# EAGLE board Proiect_TSC (EAGLE 9.7.0)
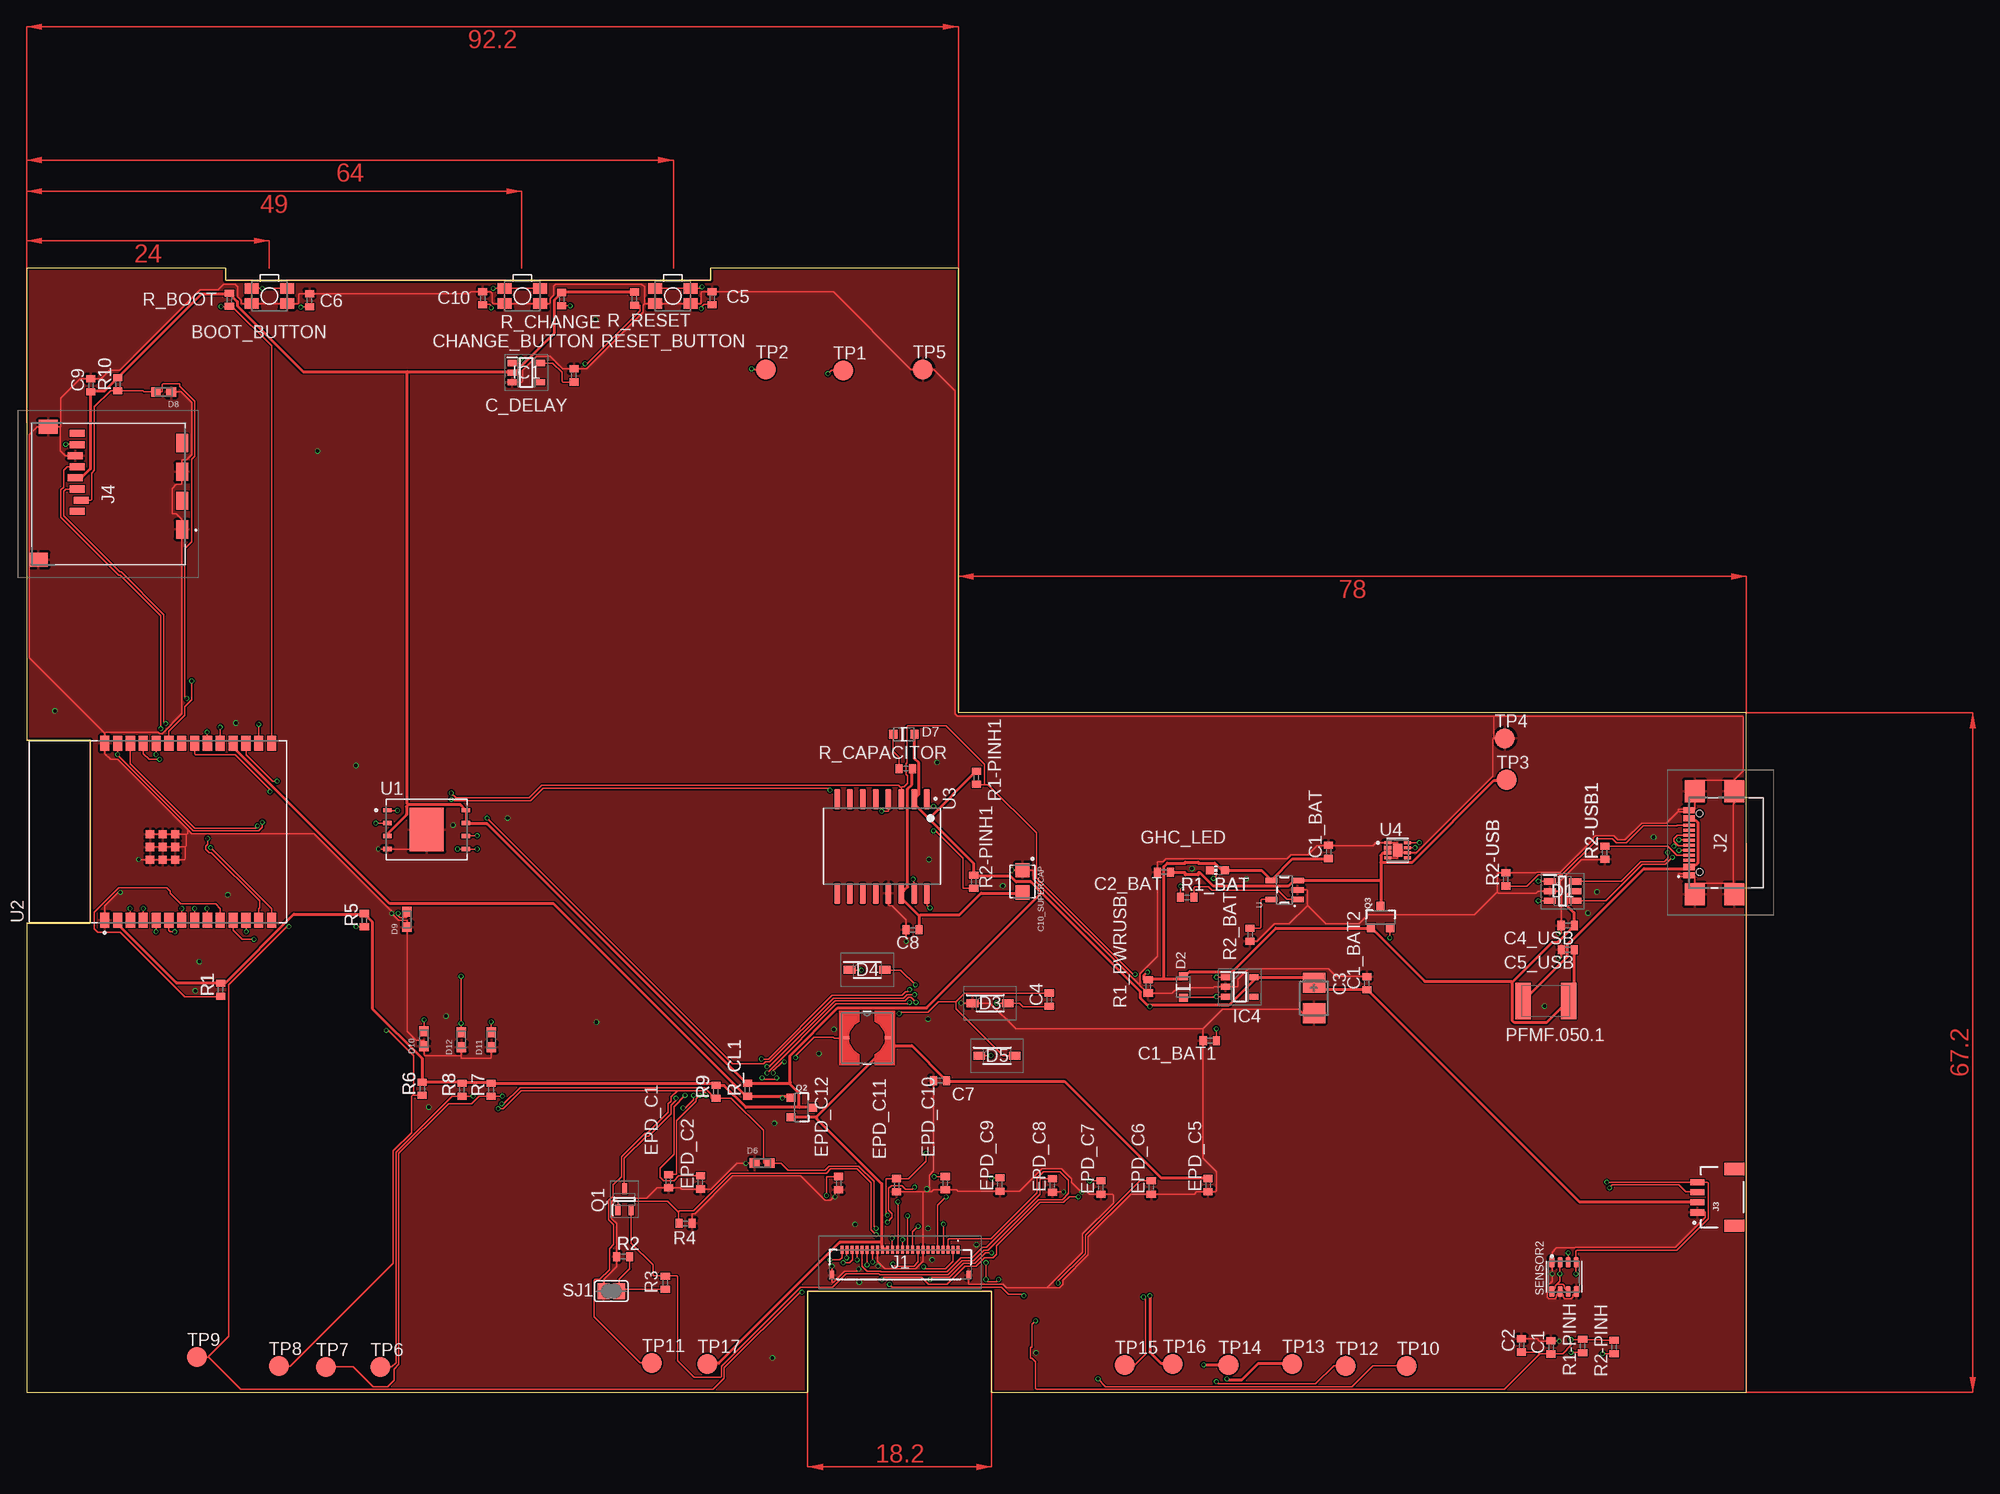
[diagram p1: board, top side]
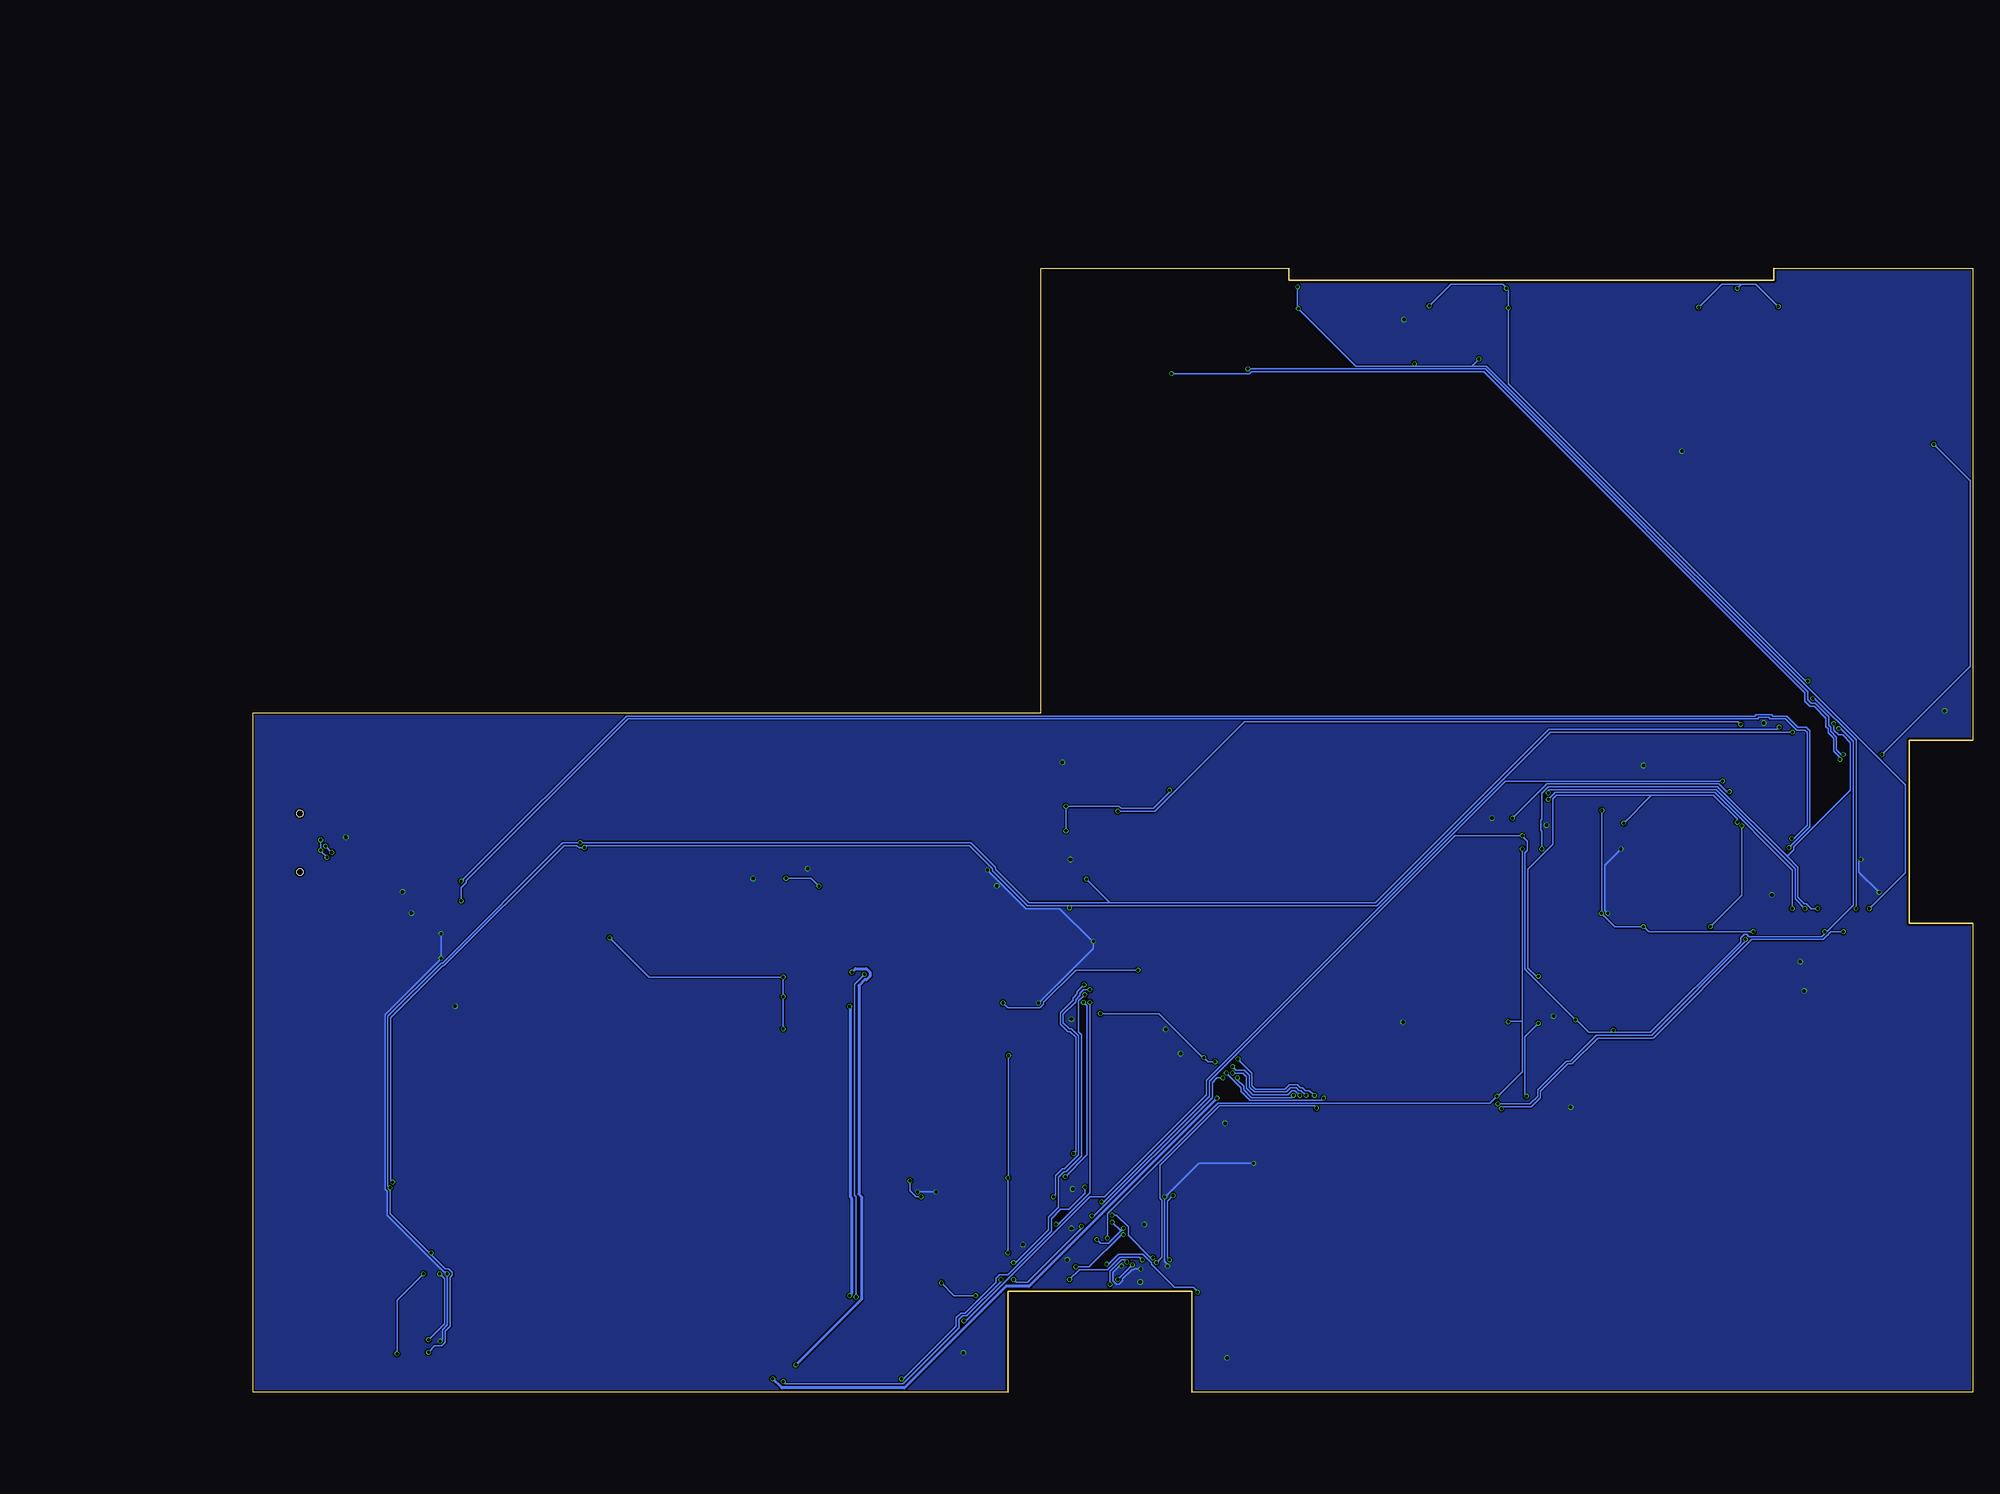
[diagram p2: board, bottom side, seen from below]

Size 170.2 x 111.2 mm. Coordinates in mm from the lower left corner, seen from the top.
Outline: 0,0 77.3,0 77.3,10 95.5,10 95.5,0 170.2,0 170.2,67.2 92.2,67.2 92.2,111.2 67.7,111.2 67.7,110 19.7,110 19.7,111.2 0,111.2 0,64.5 6.3,64.5 6.3,46.4 0,46.4 0,0
Copper layers (1*16): Top 0.035mm / dielectric 1.6mm / Bottom 0.035mm
Design rules "jlcpcb-2layers.dru *": minimum track width 0.15mm, minimum drill 0.3mm, track to track 5mil, track to pad 5mil, pad to pad 5mil, via to via 5mil, smd to smd 5mil, copper to edge 0.2mm, drill to drill 6mil, minimum pad ring 10mil, minimum via ring 3mil, stop-mask expansion 4mil, vias tented up to drill 0mil, thermal gap 10mil
Net classes: 0 default: width 0.15 mm; 1 custom_net_class: width 0.3 mm

## Footprints (pad centres in the part's own frame; a part is rotated, then mirrored left to right if it is on the bottom)
MYBUTTON = smd 1.4 x 1.05: 1 1.75,0.75; 2 -1.75,0.75; 3 -1.75,-0.75; 4 1.75,-0.75
ESP32_WROVER_EAGLE-LTSPICE_C0402 = smd 0.7 x 0.9: 1 -0.65,0; 2 0.65,0
EAGLE-LTSPICE_C0402 = smd 0.7 x 0.9: 1 -0.65,0; 2 0.65,0
RCL_CT3528 = smd 2 x 2.2: + -1.5,0; - 1.5,0
CAPCP3225X100N = smd 1.4 x 1.4: 1 -1.1,0; 2 1.1,0
SOT95P280X145-6N = smd 1.2 x 0.6: 1 -1.25,0.95; 2 -1.25,0; 3 -1.25,-0.95; 4 1.25,-0.95; 5 1.25,0; 6 1.25,0.95
ESP32_WROVER_AVX---SD0805S020S1R0_AVX_SD0805S020S1R0_0 = smd 0.8 x 0.9: 1 -1.05,0; 2 1.05,0
SOD3716X135N = smd 1.15 x 0.8: 1 -1.75,0; 2 1.75,0
DIOC1608X36N = smd 0.97 x 0.94: 1 -0.75,0; 2 0.75,0
ADAFRUIT_CHIP-LED0603 = smd 0.8 x 0.8: A 0,-0.75; C 0,0.75
SOT95P280X125-5N = smd 0.9 x 0.6: 1 -1.4,0.95; 2 -1.4,0; 3 -1.4,-0.95; 4 1.4,-0.95; 5 1.4,0.95
SOT95P280X120-5N = smd 0.9 x 0.6: 1 -1.4,0.95; 2 -1.4,0; 3 -1.4,-0.95; 4 1.4,-0.95; 5 1.4,0.95
FH34SRJ24S05SH99 = smd 0.3 x 0.8: 1 5.75,1.45; 2 5.25,1.45; 3 4.75,1.45; 4 4.25,1.45; 5 3.75,1.45; 6 3.25,1.45; 7 2.75,1.45; 8 2.25,1.45; 9 1.75,1.45; 10 1.25,1.45; 11 0.75,1.45; 12 0.25,1.45; 13 -0.25,1.45; 14 -0.75,1.45; 15 -1.25,1.45; 16 -1.75,1.45; 17 -2.25,1.45; 18 -2.75,1.45; 19 -3.25,1.45; 20 -3.75,1.45; 21 -4.25,1.45; 22 -4.75,1.45; 23 -5.25,1.45; 24 -5.75,1.45 | smd 0.4 x 0.8: MP1 6.75,-1.05; MP2 -6.75,-1.05
SAMACSYS_PARTS_USB4110GFA = smd 0.3 x 1.15: A1 -3.35,3.678; A4 -2.55,3.678; A5 -1.25,3.678; A6 -0.25,3.678; A7 0.25,3.678; A8 1.25,3.678; A9 2.55,3.678; A12 3.35,3.678; B1 3.05,3.678; B4 2.25,3.678; B5 1.75,3.678; B6 0.75,3.678; B7 -0.75,3.678; B8 -1.75,3.678; B9 -2.25,3.678; B12 -3.05,3.678 | smd 2.18 x 2: MP1 -5.11,-0.827; MP2 5.11,-0.827; MP3 -5.11,3.103; MP4 5.11,3.103 | hole 0.65: -2.89,2.603; 2.89,2.603
JST04_1MM_RA = smd 0.6 x 1.35: 1 -1.5,0; 2 -0.5,0; 3 0.5,0; 4 1.5,0 | smd 1.2 x 2: NC1 2.8,-3.675; NC2 -2.8,-3.675
112ATAARR03ATTEND = smd 1.8 x 1.2: G1 10.6,10.4; G2 4.9,10.4; S1 7.75,10.4; S2 2.05,10.4 | smd 1.4 x 1.9: G3 13.6,-3.85; G4 0.45,-2.85 | smd 0.7 x 1.5: P1 8.8,0; P2 7.7,0.4; P3 6.6,0; P4 5.5,-0.2; P5 4.4,0; P6 3.3,-0.2; P7 2.2,0; P8 1.1,0
IND_4828-WE-TPC_WRE = smd 0.61 x 0.305: 1 -2.086,0; 2 2.086,0
ESP32C6_VARISTOR_CT/CN1812 = smd 1.5 x 3.6: 1 -2.25,0; 2 2.25,0
SOT65P210X110-3N = smd 1.05 x 0.5: 1 -1.05,0.65; 2 -1.05,-0.65; 3 1.05,0
ESP32_WROVER_SPARKFUN-DISCRETESEMI_SOT23-3 = smd 0.8 x 0.9: 1 -0.95,-1; 2 0.95,-1; 3 0,1.1
ESP32_WROVER_EAGLE-LTSPICE_R0402 = smd 0.7 x 0.9: 1 -0.65,0; 2 0.65,0
ESP32_WROVER_BME680_PSON80P300X300X100-8N = smd 1.016 x 0.5: 1 1.458,1.2; 2 1.458,0.4; 3 1.458,-0.4; 4 1.458,-1.2; 5 -1.458,-1.22; 6 -1.458,-0.4; 7 -1.458,0.4; 8 -1.458,1.2
SJ = smd 1.168 x 1.6: 1 -0.762,0; 2 0.762,0
TP20R = smd 2 x 2: TP 0,0
ESP32_WROVER_SPARKFUN-IC-POWER_SOT23-5 = smd 0.55 x 1.2: 1 -0.95,-1.3; 2 0,-1.3; 3 0.95,-1.3; 4 0.95,1.3; 5 -0.95,1.3
SON127P600X800X80-9N = smd 0.94 x 0.44: 1 -3.895,1.905; 2 -3.895,0.635; 3 -3.895,-0.635; 4 -3.895,-1.905; 5 3.895,-1.905; 6 3.895,-0.635; 7 3.895,0.635; 8 3.895,1.905 | smd 3.4 x 4.3: 9 0,0
XCVR_ESP32-C6-WROOM-1-N8 = smd 1.5 x 0.9: 1 -8.75,5.26; 2 -8.75,3.99; 3 -8.75,2.72; 4 -8.75,1.45; 5 -8.75,0.18; 6 -8.75,-1.09; 7 -8.75,-2.36; 8 -8.75,-3.63; 9 -8.75,-4.9; 10 -8.75,-6.17; 11 -8.75,-7.44; 12 -8.75,-8.71; 13 -8.75,-9.98; 14 -8.75,-11.25; 15 8.75,-11.25; 16 8.75,-9.98; 17 8.75,-8.71; 18 8.75,-7.44; 19 8.75,-6.17; 20 8.75,-4.9; 21 8.75,-3.63; 22 8.75,-2.36; 23 8.75,-1.09; 24 8.75,0.18; 25 8.75,1.45; 26 8.75,2.72; 27 8.75,3.99; 28 8.75,5.26 | smd 0.8 x 0.8: 29_1 -2.755,0.79; 29_2 -1.505,0.79; 29_3 -0.255,0.79; 29_4 -2.755,-0.46; 29_5 -1.505,-0.46; 29_6 -0.255,-0.46; 29_7 -2.755,-1.71; 29_8 -1.505,-1.71; 29_9 -0.255,-1.71
SOIC127P1032X265-16N = smd 2.05 x 0.59: 1 -4.655,4.445; 2 -4.655,3.175; 3 -4.655,1.905; 4 -4.655,0.635; 5 -4.655,-0.635; 6 -4.655,-1.905; 7 -4.655,-3.175; 8 -4.655,-4.445; 9 4.655,-4.445; 10 4.655,-3.175; 11 4.655,-1.905; 12 4.655,-0.635; 13 4.655,0.635; 14 4.655,1.905; 15 4.655,3.175; 16 4.655,4.445
SON50P200X200X80-9N = smd 0.76 x 0.27: 1 -0.985,0.75; 4 -0.985,-0.75; 5 0.985,-0.75; 6 0.985,-0.25; 7 0.985,0.25; 8 0.985,0.75 | smd 0.813 x 0.406: 2 -0.985,0.25; 3 -0.985,-0.25 | smd 0.9 x 1.3: 9 0,0

## Placement (x,y rotation side)
BOOT_BUTTON  BUTTON_CUSYOMV1  [MYBUTTON]  24.03,108.45 180 top
C1  100nF  [ESP32_WROVER_EAGLE-LTSPICE_C0402]  150.84,4.43 90 top
C1_BAT  4.7uF  [EAGLE-LTSPICE_C0402]  128.83,53.45 90 top
C1_BAT1  4.7uF  [EAGLE-LTSPICE_C0402]  117.08,34.77 180 top
C1_BAT2  4.7uf  [EAGLE-LTSPICE_C0402]  132.62,40.47 90 top
C2  100nF  [ESP32_WROVER_EAGLE-LTSPICE_C0402]  147.92,4.63 90 top
C2_BAT  4.7uF  [EAGLE-LTSPICE_C0402]  112.55,51.45 180 top
C3  100uF TANT  [RCL_CT3528]  127.41,39 270 top
C4  4.7uF/25V  [ESP32_WROVER_EAGLE-LTSPICE_C0402]  101.2,38.84 90 top
C4_USB  100nF  [ESP32_WROVER_EAGLE-LTSPICE_C0402]  152.5,46.17 180 top
C5  1uF  [ESP32_WROVER_EAGLE-LTSPICE_C0402]  67.85,108.23 90 top
C5_USB  4.7uF  [ESP32_WROVER_EAGLE-LTSPICE_C0402]  152.51,43.77 180 top
C6  100nF  [ESP32_WROVER_EAGLE-LTSPICE_C0402]  28,108.03 90 top
C7  10uF  [ESP32_WROVER_EAGLE-LTSPICE_C0402]  90.39,30.83 180 top
C8  100nF  [ESP32_WROVER_EAGLE-LTSPICE_C0402]  87.68,45.73 180 top
C9  100nF  [ESP32_WROVER_EAGLE-LTSPICE_C0402]  6.36,99.63 90 top
C10  100nF  [ESP32_WROVER_EAGLE-LTSPICE_C0402]  45.14,108.23 90 top
C10_SUPERCAP  CPH3225A  [CAPCP3225X100N]  98.56,50.54 270 top
C_DELAY  100nF  [ESP32_WROVER_EAGLE-LTSPICE_C0402]  54.17,100.59 90 top
CHANGE_BUTTON  BUTTON_CUSYOMV1  [MYBUTTON]  49.06,108.45 180 top
D1  USBLC6-2SC6Y  [SOT95P280X145-6N]  151.98,49.57 0 top
D2  SD0805S020S1R0  [ESP32_WROVER_AVX---SD0805S020S1R0_AVX_SD0805S020S1R0_0]  114.46,40.08 90 top
D3  MBR0530  [SOD3716X135N]  95.35,38.48 0 top
D4  MBR0530  [SOD3716X135N]  83.19,41.78 0 top
D5  MBR0530  [SOD3716X135N]  96.03,33.28 0 top
D6  PGB1010603MR  [DIOC1608X36N]  72.78,22.67 0 top
D7  ESP32_WROVER_AVX---SD0805S020S1R0_AVX_SD0805S020S1R0_0_0AVX_SD0805S020S1R0_0_0  [ESP32_WROVER_AVX---SD0805S020S1R0_AVX_SD0805S020S1R0_0]  86.81,65.08 0 top
D8  PGB1010603MR  [DIOC1608X36N]  13.56,98.97 180 top
D9  PGB1010603MR  [DIOC1608X36N]  37.64,46.77 90 top
D10  PGB1010603MR  [DIOC1608X36N]  39.32,34.97 90 top
D11  PGB1010603MR  [DIOC1608X36N]  46,34.87 90 top
D12  PGB1010603MR  [DIOC1608X36N]  43.03,34.87 90 top
EPD_C1  1uF/50V  [ESP32_WROVER_EAGLE-LTSPICE_C0402]  63.52,20.87 90 top
EPD_C2  1uF/50V  [ESP32_WROVER_EAGLE-LTSPICE_C0402]  66.68,20.75 90 top
EPD_C5  0.1uF/50V  [ESP32_WROVER_EAGLE-LTSPICE_C0402]  116.91,20.49 90 top
EPD_C6  1uF/50V  [ESP32_WROVER_EAGLE-LTSPICE_C0402]  111.29,20.25 90 top
EPD_C7  1uF/50V  [ESP32_WROVER_EAGLE-LTSPICE_C0402]  106.3,20.25 90 top
EPD_C8  1uF/50V  [ESP32_WROVER_EAGLE-LTSPICE_C0402]  101.51,20.45 90 top
EPD_C9  1uF/50V  [ESP32_WROVER_EAGLE-LTSPICE_C0402]  96.32,20.55 90 top
EPD_C10  1uF/50V  [ESP32_WROVER_EAGLE-LTSPICE_C0402]  90.91,20.69 90 top
EPD_C11  1uF/50V  [ESP32_WROVER_EAGLE-LTSPICE_C0402]  86.09,20.49 90 top
EPD_C12  1uF/50V  [ESP32_WROVER_EAGLE-LTSPICE_C0402]  80.35,20.69 90 top
GHC_LED  [ADAFRUIT_CHIP-LED0603]  117.84,51.65 90 top
IC1  BD5229G-TR  [SOT95P280X125-5N]  49.45,100.87 0 top
IC4  XC6220A331MR-G  [SOT95P280X120-5N]  120.05,40.09 0 top
J1  FH34SRJ-24S-0.5SH_99_  [FH34SRJ24S05SH99]  86.44,12.64 0 top
J2  SAMACSYS_PARTS_USB4110-GF-A  [SAMACSYS_PARTS_USB4110GFA]  168.17,54.36 90 top
J3  QWIIC_RIGHT_ANGLE  [JST04_1MM_RA]  165.32,19.28 90 top
J4  112A-TAAR-R03_ATTEND  [112ATAARR03ATTEND]  5,95.95 270 top
L1  68uH  [IND_4828-WE-TPC_WRE]  83.17,35.05 0 top
PFMF.050.1  ESP32C6_VARISTORCN1812  [ESP32C6_VARISTOR_CT/CN1812]  150.34,38.7 0 top
Q1  SI1308EDL-T1-GE3  [SOT65P210X110-3N]  59.16,19.08 90 top
Q2  20V/4.2A/52mΩ/1.4W  [ESP32_WROVER_SPARKFUN-DISCRETESEMI_SOT23-3]  76.66,28.16 270 top
Q3  20V/4.2A/52mΩ/1.4W  [ESP32_WROVER_SPARKFUN-DISCRETESEMI_SOT23-3]  133.98,46.96 0 top
R1  10k  [ESP32_WROVER_EAGLE-LTSPICE_R0402]  19.19,39.81 90 top
R1-PINH  10k  [ESP32_WROVER_EAGLE-LTSPICE_R0402]  153.98,4.57 90 top
R1-PINH1  10k  [ESP32_WROVER_EAGLE-LTSPICE_R0402]  93.99,60.79 90 top
R1_BAT  200  [ESP32_WROVER_EAGLE-LTSPICE_R0402]  114.85,48.95 0 top
R1_PWRUSB  100k  [ESP32_WROVER_EAGLE-LTSPICE_R0402]  110.99,40.14 90 top
R2  2.2  [ESP32_WROVER_EAGLE-LTSPICE_R0402]  59.03,13.41 0 top
R2-PINH  10k  [ESP32_WROVER_EAGLE-LTSPICE_R0402]  157.09,4.47 90 top
R2-PINH1  10k  [ESP32_WROVER_EAGLE-LTSPICE_R0402]  93.73,50.49 90 top
R2-USB  5k1  [ESP32_WROVER_EAGLE-LTSPICE_R0402]  146.38,50.73 90 top
R2-USB1  5k1  [ESP32_WROVER_EAGLE-LTSPICE_R0402]  156.16,53.37 90 top
R2_BAT  2k  [ESP32_WROVER_EAGLE-LTSPICE_R0402]  121.06,45.25 90 top
R3  0.47  [ESP32_WROVER_EAGLE-LTSPICE_R0402]  63.21,10.83 90 top
R4  10k  [ESP32_WROVER_EAGLE-LTSPICE_R0402]  65.21,16.71 180 top
R5  10k  [ESP32_WROVER_EAGLE-LTSPICE_R0402]  33.43,46.71 90 top
R6  10k  [ESP32_WROVER_EAGLE-LTSPICE_R0402]  39.15,30.01 90 top
R7  10k  [ESP32_WROVER_EAGLE-LTSPICE_R0402]  45.97,29.91 90 top
R8  10k  [ESP32_WROVER_EAGLE-LTSPICE_R0402]  43.09,29.91 90 top
R9  10k  [ESP32_WROVER_EAGLE-LTSPICE_R0402]  68.21,29.71 90 top
R10  10k  [ESP32_WROVER_EAGLE-LTSPICE_R0402]  9.03,99.73 90 top
R_BOOT  10k  [ESP32_WROVER_EAGLE-LTSPICE_R0402]  20.07,108.07 90 top
R_CAPACITOR  15  [ESP32_WROVER_EAGLE-LTSPICE_R0402]  87,61.68 0 top
R_CHANGE  10k  [ESP32_WROVER_EAGLE-LTSPICE_R0402]  52.96,108.14 90 top
R_CL1  10k  [ESP32_WROVER_EAGLE-LTSPICE_R0402]  71.33,29.93 90 top
R_RESET  10k  [ESP32_WROVER_EAGLE-LTSPICE_R0402]  60.15,108.19 90 top
RESET_BUTTON  BUTTON_CUSYOMV1  [MYBUTTON]  63.95,108.45 180 top
SENSOR2  BME688  [ESP32_WROVER_BME680_PSON80P300X300X100-8N]  152.14,11.42 90 top
SJ1  [SJ]  57.86,9.99 0 top
TP1  TPTP20R  [TP20R]  80.81,101.09 0 top
TP2  TPTP20R  [TP20R]  73.13,101.19 0 top
TP3  TPTP20R  [TP20R]  146.45,60.59 0 top
TP4  TPTP20R  [TP20R]  146.27,64.69 0 top
TP5  TPTP20R  [TP20R]  88.69,101.19 0 top
TP6  TPTP20R  [TP20R]  35.01,2.49 0 top
TP7  TPTP20R  [TP20R]  29.63,2.49 0 top
TP8  TPTP20R  [TP20R]  24.95,2.59 0 top
TP9  TPTP20R  [TP20R]  16.87,3.49 0 top
TP10  TPTP20R  [TP20R]  136.58,2.61 0 top
TP11  TPTP20R  [TP20R]  61.89,2.89 0 top
TP12  TPTP20R  [TP20R]  130.53,2.61 0 top
TP13  TPTP20R  [TP20R]  125.22,2.81 0 top
TP14  TPTP20R  [TP20R]  118.93,2.71 0 top
TP15  TPTP20R  [TP20R]  108.68,2.71 0 top
TP16  TPTP20R  [TP20R]  113.43,2.81 0 top
TP17  TPTP20R  [TP20R]  67.38,2.81 0 top
U  MCP73831  [ESP32_WROVER_SPARKFUN-IC-POWER_SOT23-5]  124.48,49.69 90 top
U1  W25Q512JVEIQ  [SON127P600X800X80-9N]  39.59,55.66 0 top
U2  ESP32-C6-WROOM-1-N8  [XCVR_ESP32-C6-WROOM-1-N8]  13,55.44 90 top
U3  DS3231SN#  [SOIC127P1032X265-16N]  84.65,54 270 top
U4  MAX17048G+T10  [SON50P200X200X80-9N]  135.67,53.62 0 top

## Tracks (layer width: path | path; a pad name or v marks a point on that pad's centre or on a via)
3V3  (via drill 0.3)
  Top 0.3: 89.3,56.75 87.88,58.17 87.88,58.66 U3.2 87.95,58.79 88.29,59.14 88.29,62.26 87.88,62.67 87.88,65.03 D7.2 | 89.3,56.75 93.69,52.35 93.69,51.18 R2-PINH1.2 93.83,51.04 97.36,51.04 97.92,50.48 99.37,50.48 100.45,49.41 | 89.3,56.75 93.97,61.42 R1-PINH1.2 | J3.2 165.3,18.84 153.67,18.84 132.75,39.75 C1_BAT2.1 132.61,39.89 127.97,39.89 127.49,40.37 C3.+ 127.35,40.51 126.87,41 121.47,41 IC4.5 121.53,40.86 118.97,38.3 111.15,38.3 | 100.45,49.41 110.25,39.61 110.25,38.99 110.94,38.3 111.15,38.3 | R_RESET.2 60.11,108.86 53.05,108.86 R_CHANGE.2 52.91,108.72 52.22,108.03 52.22,104.78 48.34,100.9 48.06,100.9 IC1.2 47.92,100.97 37.67,100.97 | J4.P4 4.85,90.51 5.47,90.51 6.3,91.34 6.3,98.89 C9.1 6.37,99.03 7.69,99.03 9,100.34 R10.2 9.14,100.48 17.31,108.65 20.01,108.65 R_BOOT.2 20.15,108.58 20.84,107.89 20.84,107.48 27.35,100.97 37.67,100.97 | U2.2 9.07,46.67 9.07,46.26 14.82,40.51 19.18,40.51 R1.2 19.32,40.58 19.74,40.58 26.45,47.3 33.38,47.3 R5.2 33.52,47.23 34.21,46.54 34.21,37.95 39.13,33.03 39.13,30.82 R6.2 39.2,30.68 43,30.68 R8.2 43.14,30.61 45.91,30.61 R7.2 46.12,30.54 67.93,30.54 68.07,30.4 R9.2 68.21,30.33 69.04,30.33 71.19,28.18 76.45,28.18 | 37.74,58.1 37.6,57.96 37.6,57.13 35.73,55.26 35.73,55.05 U1.3 | 37.74,58.1 42.94,58.1 43.42,57.62 U1.8 43.49,57.48 U1.7 43.63,56.23 45.57,56.23 71.19,30.61 R_CL1.2 71.4,30.54 75.48,30.54 | 76.45,28.18 77.7,28.18 Q2.3 | 75.48,30.54 76.45,29.57 76.45,28.18 | 37.67,100.97 37.67,58.24 37.74,58.1 | 100.45,49.41 89.06,38.02 80.26,38.02 75.55,33.31 75.55,30.68 75.48,30.54 | v111.15,9.56 111.15,3.95 112.25,2.84 113.36,2.84 TP16.TP
  Top 0.3: v111.15,38.16 111.15,38.3
  Bottom 0.3: v111.15,9.56 110.94,9.76 110.94,19.18 111.08,19.32 111.08,38.09 v111.15,38.16
32KHZ  (via drill 0.3)
  Top 0.15: v89.75,55.54 89.96,55.54 92.66,52.84 92.66,49.93 92.73,49.86 93.69,49.86 R2-PINH1.1 | v89.75,57.96 89.12,57.96 89.12,58.66 U3.1 | v17.87,47.85 17.87,46.74 U2.9 | v42.03,58.66 42.24,58.66 42.38,58.52 49.86,58.52 51.11,59.76 79.29,59.76 v79.5,59.55
  Bottom 0.15: v89.75,55.54 v89.75,57.96 84.48,57.96 84.28,57.76 81.09,57.76 79.5,59.35 v79.5,59.55 | v17.87,47.85 17.87,51.66 25.55,59.35 41.34,59.35 v42.03,58.66
DN  (via drill 0.3)
  Top 0.15: v163.5,53.6 164.47,53.6 J2.B7 | v163.5,54.64 164.47,54.64 J2.A7 | v162.88,52.91 162.18,52.22 159.9,52.22 156.3,48.61 153.25,48.61 D1.4
  Bottom 0.15: v163.5,54.64 v163.5,53.6 163.5,53.53 v162.88,52.91
DP  (via drill 0.3)
  Top 0.15: 163.26,54.26 163.01,54.5 163.01,54.78 163.36,55.12 164.47,55.12 J2.B6 | 163.26,54.26 163.43,54.08 164.47,54.08 J2.A6 | v162.39,53.39 162.39,52.84 162.04,52.49 159.76,52.49 157.82,50.55 153.25,50.55 D1.6 | 163.26,54.26 v163.01,54.02
  Bottom 0.15: v163.01,54.02 v162.39,53.39
EPD_3V3
  Top 0.3: J1.15 85.18,14.13 84.69,14.13 J1.16 84.62,14.27 84.62,14.82 | 78.11,27.21 75.69,27.21 Q2.2 | 85.25,34.35 78.11,27.21 | 85.25,34.35 85.25,35.04 L1.2 | 85.25,34.35 85.39,34.28 87.6,34.28 91,30.89 C7.1 91.13,30.75 102.7,30.75 112.25,21.19 116.89,21.19 EPD_C5.2 | 84.62,14.82 84.62,20.64 78.18,27.08 78.11,27.21 | 84.62,14.82 80.47,14.82 68.49,2.84 67.38,2.84 TP17.TP
EPD_3V3_C  (via drill 0.3)
  Top 0.3: 74.79,29.22 75.55,29.22 75.62,29.15 Q2.1 | 74.79,29.22 71.4,29.22 R_CL1.1 71.19,29.29 52.15,48.34 35.94,48.34 20.5,63.78 20.5,64.13 U2.18 | v118.76,1.32 118.83,1.25 120.29,1.25 121.88,2.84 125.2,2.84 TP13.TP | 74.79,29.22 v74.79,29.09
  Bottom 0.3: v118.76,1.32 117.86,0.41 105.75,0.41 95.7,10.46 93.42,10.46 v74.79,29.09
EPD_BUSY  (via drill 0.3)
  Top 0.15: v85.73,12.67 85.94,12.46 87.81,12.46 88.22,12.88 88.22,14.06 J1.9 | v76.73,9.9 76.52,9.9 69.04,2.42 69.04,1.39 67.93,0.28 21.19,0.28 18,3.46 | 18,3.46 16.9,3.46 TP9.TP | v22.85,56.02 22.64,55.82 16.62,55.82 10.25,62.19 10.25,64.13 U2.26 | v25.97,46.05 25.76,46.05 20.01,40.3 20.01,5.54 18,3.53 18,3.46
  Bottom 0.15: v85.73,12.67 85.52,12.67 84.55,13.64 82.13,13.64 81.3,12.81 81.3,12.67 79.01,10.39 77.14,10.39 76.73,9.97 v76.73,9.9 | v22.85,56.02 22.85,49.17 v25.97,46.05
EPD_CS  (via drill 0.3)
  Top 0.15: v86.7,15.1 86.7,14.13 J1.12 | v84.07,16.2 83.86,16.41 83.86,20.84 82.34,22.37 79.43,22.37 79.01,21.95 75.34,21.95 74.65,22.64 73.54,22.64 D6.2 73.47,22.64 72.99,22.64 72.92,22.71 72.92,25.9 69.73,29.09 68.21,29.09 R9.1 68.14,29.09 67.73,29.09 67.73,29.5 67.1,30.12 48.82,30.12 47.23,28.53 v47.02,28.53 | v22.51,44.8 21.33,44.8 20.43,45.7 20.43,46.67 U2.11 | v106.02,1.32 106.78,0.55 131.16,0.55 133.24,2.63 136.56,2.63 TP10.TP | v87.88,20.29 87.67,20.08 86.98,20.08 86.63,20.43 85.59,20.43 85.32,20.15 85.32,18 85.66,17.66 85.66,17.31 v85.18,16.83
  Bottom 0.15: v86.7,15.1 86.36,14.75 85.52,14.75 84.31,15.96 | v84.07,16.2 84.31,15.96 | v22.51,44.8 22.51,44.6 31.79,35.32 37.26,35.32 39.82,32.76 40.23,32.76 43.07,29.92 43.07,29.29 43.84,28.53 v47.02,28.53 | v106.02,1.32 105.81,1.32 100.62,6.51 100.62,7.34 100.14,7.83 99.72,7.83 96.67,10.87 96.67,11.29 96.33,11.63 95.5,11.63 91.2,15.93 91.2,17.17 90.3,18.07 89.47,18.07 87.88,19.67 v87.88,20.29 | 84.31,15.96 v85.18,16.83
EPD_DC  (via drill 0.3)
  Top 0.15: v87.19,17.45 87.19,14.13 J1.11 | v74.24,31.09 74.1,30.95 72.92,30.95 v72.78,31.09 | v67.24,29.36 67.24,29.57 66.97,29.85 64.4,29.85 | 64.4,29.85 63.78,29.22 63.78,28.81 63.5,28.53 63.5,27.7 61.42,25.62 61.22,25.62 58.86,23.27 58.86,21.33 58.03,20.5 58.03,19.39 57.62,18.97 57.62,17.04 58.1,16.55 58.1,14.61 57.69,14.2 57.69,12.12 56.72,11.15 56.23,11.15 56.16,11.08 56.16,7.48 60.73,2.91 61.84,2.91 TP11.TP | v12.81,45.57 12.81,46.67 U2.5 | v46.67,28.05 47.16,28.05 48.96,29.85 64.4,29.85
  Bottom 0.15: v87.19,17.45 86.98,17.45 75.28,29.15 75.28,30.61 74.79,31.09 v74.24,31.09 | v72.78,31.09 72.78,30.89 72.16,30.26 72.16,29.92 71.4,29.15 67.45,29.15 v67.24,29.36 | v12.81,45.57 14.06,45.57 14.34,45.29 14.34,45.22 14.4,45.22 14.82,44.8 21.88,44.8 31.65,35.04 37.12,35.04 39.68,32.48 40.1,32.48 42.8,29.78 42.8,29.15 43.7,28.25 46.47,28.25 v46.67,28.05
EPD_RST  (via drill 0.3)
  Top 0.15: v88.22,16.41 87.67,15.86 87.67,14.13 J1.10 | v96.19,11.15 95.98,10.94 95.15,10.94 v94.94,11.15 v94.94,12.81 | v117.72,1.04 117.93,0.83 127.56,0.83 129.36,2.63 130.47,2.63 TP12.TP | v24.1,59.42 24.1,59.62 20.64,63.09 16.69,63.09 16.62,63.16 16.62,64.13 U2.21 | v45.57,56.78 69.87,32.48 72.92,32.48 73.13,32.69 73.54,32.69 79.84,38.99 86.77,38.99 87.12,39.33 v87.88,39.33
  Bottom 0.15: v88.22,16.41 88.22,16.2 93.56,10.87 94.67,10.87 v94.94,11.15 | v96.19,11.15 96.19,10.94 99.58,7.55 100,7.55 100.34,7.2 100.34,6.37 105.88,0.83 117.52,0.83 v117.72,1.04 | v24.1,59.42 24.38,59.42 25.14,60.18 42.17,60.18 v45.57,56.78 | v87.88,39.33 88.5,38.71 88.5,35.66 88.22,35.39 88.22,23.34 89.75,21.81 89.96,21.81 90.51,21.26 90.51,18.28 91.48,17.31 91.48,16.07 94.73,12.81 v94.94,12.81
FLASH_CS  (via drill 0.3)
  Top 0.15: v32.62,46.05 33.38,46.05 R5.1 | v36.77,47.37 36.77,47.16 36.98,46.95 37.6,46.95 37.67,47.02 37.67,47.51 D9.2 | v36.7,57.55 35.73,57.55 U1.1 | v21.74,45.57 21.74,46.67 U2.12
  Bottom 0.15: v36.7,57.55 36.7,47.37 v36.77,47.37 35.46,46.05 v32.62,46.05 32.55,46.05 32.06,45.57 v21.74,45.57
GDR  (via drill 0.3)
  Top 0.15: v88.78,12.4 88.99,12.19 90.92,12.19 91.69,12.95 91.69,14.06 J1.2 | v84.07,15.58 83.58,16.07 83.58,20.71 82.2,22.09 79.57,22.09 79.15,21.68 69.73,21.68 66,17.94 64.61,17.94 64.54,17.87 | 64.54,17.87 64.54,16.76 R4.2 | Q1.1 58.52,18.07 58.52,18.84 58.59,18.91 63.43,18.91 64.47,17.87 64.54,17.87
  Bottom 0.15: v88.78,12.4 87.46,12.4 84.28,15.58 v84.07,15.58
GND  (via drill 0.3, 0.35)
  Top 0.15: IC1.3 49.03,99.93 49.1,100 49.1,101.11 50.48,102.49 51.8,102.49 53.05,101.24 54.15,101.24 C_DELAY.2 54.22,101.24 55.4,101.24 61.01,106.85 61.01,107.55 61.15,107.68 | 61.15,107.68 62.19,107.68 RESET_BUTTON.1 62.26,107.68 65.65,107.68 RESET_BUTTON.2 65.72,107.68 66.69,107.68 66.76,107.75 66.76,108.79 66.83,108.86 67.8,108.86 C5.2 67.86,108.86 79.84,108.86 87.53,101.17 88.64,101.17 TP5.TP 88.71,101.17 89.82,101.17 91.89,99.1 91.89,67.1 92.1,66.89 145.22,66.89 145.22,66.83 | 3.32,95.5 3.39,95.56 3.39,98.33 5.33,100.27 6.3,100.27 C9.2 6.37,100.27 7.41,100.27 8.24,101.11 9.21,101.11 17.17,109.07 18.97,109.07 19.53,109.62 20.64,109.62 20.91,109.35 20.91,108.38 21.26,108.03 21.26,107.75 21.33,107.68 22.23,107.68 BOOT_BUTTON.1 22.3,107.68 25.76,107.68 BOOT_BUTTON.2 25.83,107.68 26.87,107.68 26.94,107.75 26.94,108.58 27.01,108.65 27.98,108.65 C6.2 28.05,108.65 43.77,108.65 43.97,108.86 45.08,108.86 C10.2 45.15,108.86 45.91,108.86 46.05,108.72 46.05,107.82 46.19,107.68 47.3,107.68 CHANGE_BUTTON.1 47.37,107.68 50.76,107.68 CHANGE_BUTTON.2 50.83,107.68 51.73,107.68 51.8,107.75 51.8,108.17 52.15,108.52 52.15,109.42 52.35,109.62 60.87,109.62 61.15,109.35 61.15,107.68 | 3.32,95.5 2.22,95.5 J4.G4 2.08,95.5 1.04,95.5 0.28,94.73 0.28,82.34 1.11,82.34 J4.G3 0.28,82.27 0.28,72.64 7.69,65.23 7.76,65.23 | 3.32,95.5 3.32,93.14 3.81,92.66 4.78,92.66 J4.P6 | U1.9 39.61,55.61 39.61,54.5 38.85,53.74 35.73,53.74 U1.4 35.66,53.74 v34.83,53.74 | 43,33.31 43,33.1 43.07,33.03 45.91,33.03 45.98,33.1 45.98,34.07 D11.1 | 43,33.31 43,34.07 D12.1
  Top 0.15: 43,33.31 39.4,33.31 39.33,33.38 39.33,34.21 D10.1 39.33,34.28 39.33,34.83 38.57,34.83 37.67,35.73 37.67,45.98 D9.1 37.67,46.05 37.67,46.67 36.84,46.67 v36.15,47.37 36.15,47.58 28.46,55.26 16.34,55.26 16,55.61 15.93,55.61 | D8.1 14.34,98.96 15.3,98.96 16.34,97.92 16.34,92.73 15.86,92.24 15.44,92.24 15.37,92.17 15.37,91.06 J4.G2 15.37,91 15.37,89.89 15.3,89.82 14.82,89.82 14.4,89.4 14.4,86.98 14.47,86.91 14.82,86.91 15.37,86.36 15.37,85.39 J4.G1 15.37,85.32 15.37,67.1 13.43,65.16 13.16,65.16 13.02,65.3 7.83,65.3 7.76,65.23 | v9.28,49.44 9.07,49.44 7.76,48.13 7.76,46.74 U2.1 | v11.08,52.7 12.19,52.7 U2.29_1 12.26,52.7 13.43,52.7 U2.29_4 13.5,52.7 14.68,52.7 U2.29_7 14.75,52.7 15.65,52.7 15.72,52.77 15.72,53.95 | U2.29_2 12.26,53.95 13.43,53.95 U2.29_5 13.5,53.95 14.68,53.95 U2.29_8 14.75,53.95 15.72,53.95 | U2.29_3 12.26,55.19 13.43,55.19 U2.29_6 13.5,55.19 14.68,55.19 U2.29_9 14.75,55.19 15.79,55.19 | 15.93,55.61 15.93,55.26 15.86,55.19 15.79,55.19 | 15.93,55.61 15.93,55.68 9,62.6 8.31,62.6 7.76,63.16 7.76,64.13 U2.28 7.76,64.26 7.76,65.23 | 15.72,53.95 15.79,54.02 15.79,55.19 | U3.13 85.32,49.31 85.32,48.2 85.39,48.13 85.66,48.13 87.05,46.74 87.05,45.77 C8.2 87.05,45.7 v87.05,44.6 | 116.41,35.94 116.41,34.83 C1_BAT1.2 116.41,34.76 116.41,23.13 117.72,21.81 117.72,19.88 117.66,19.8 116.96,19.8 EPD_C5.1 116.89,19.8 115.79,19.8 115.58,19.6 111.35,19.6 EPD_C6.1 111.22,19.6 109.28,19.6 105.05,15.37 105.05,13.57 102.56,11.08 102.56,10.66 102.21,10.32 100.97,10.32 | 116.41,35.94 118.35,37.88 125.9,37.88 126.24,37.53 127.35,37.53 C3.-
  Top 0.15: 116.41,35.94 97.92,35.94 95.36,38.5 93.63,38.5 D3.1 93.56,38.5 v92.45,38.5 | v79.71,12.46 79.71,11.63 J1.MP2 79.71,11.56 79.71,10.87 79.84,10.87 80.95,11.98 82.13,11.98 v82.34,12.19 | EPD_C12.1 80.33,20.01 79.98,20.01 v79.98,19.32 79.92,19.32 79.57,18.97 79.01,18.97 76.59,21.4 69.87,21.4 66.13,17.66 65.86,17.66 65.86,16.76 R4.1 | SJ1.1 57.13,10.04 57.13,11.15 58.38,12.4 58.38,13.37 R2.1 58.38,13.43 58.38,16.69 57.89,17.17 57.89,18.84 58.17,19.11 58.38,19.11 58.45,19.18 61.35,19.18 62.39,20.22 63.5,20.22 EPD_C1.1 63.57,20.22 64.68,20.22 64.82,20.08 66.62,20.08 EPD_C2.1 66.69,20.08 67.73,20.08 70.29,22.64 v71.19,22.64 72.02,22.64 D6.1 | 84.48,12.67 84.97,12.19 87.95,12.19 88.71,12.95 88.71,14.06 J1.8 88.71,14.13 88.71,19.8 | 84.48,12.67 84.21,12.95 84.21,14.06 J1.17 | 89.33,19.8 89.54,19.8 89.75,20.01 90.86,20.01 EPD_C10.1 90.92,20.01 92.03,20.01 92.17,19.88 96.26,19.88 EPD_C9.1 96.33,19.88 98.27,19.88 100.48,22.09 102.42,22.09 103.39,21.12 103.39,20.77 104.36,19.8 v104.43,19.8 104.98,19.8 105.19,19.6 106.23,19.6 EPD_C7.1 106.37,19.6 107.48,19.6 107.55,19.53 107.55,18.7 104.5,15.65 104.5,13.85 100.97,10.32 | 89.33,19.8 88.71,19.8 | 88.71,19.8 86.15,19.8 EPD_C11.1 | 89.33,19.8 89.33,21.47 89.75,21.88 89.75,30.82 C7.2 | 100.97,10.32 96.95,10.32 96.6,10.66 93.21,10.66 93.21,11.56 J1.MP1 | v102.63,19.8 EPD_C8.1 | 84.48,12.67 v84.28,12.46 | C2.2 147.99,5.26 149.51,5.26 149.72,5.05 150.83,5.05 C1.2 150.9,5.05 v151.66,5.05 | J3.1 165.37,17.8 166.13,17.8 166.13,17.31 163.15,14.34 153.25,14.34 153.18,14.27 151.38,14.27 150.97,13.85 150.97,12.88 SENSOR2.1 150.97,12.81 v150.97,11.7
  Top 0.15: 126.73,48.13 124.93,46.33 123.47,46.33 121.74,44.6 121.12,44.6 R2_BAT.1 | 126.73,48.13 126.73,49.65 126.66,49.72 125.83,49.72 U.2 | 145.56,49.44 145.56,51.31 145.63,51.38 146.32,51.38 R2-USB.2 146.39,51.38 149.37,51.38 149.44,51.45 151.8,51.45 155.05,54.71 155.05,54.85 155.26,55.05 157.06,55.05 157.47,54.64 158.17,54.64 159.83,56.3 162.25,56.3 163.43,57.48 | 145.56,49.44 145.63,49.38 149.37,49.38 149.58,49.58 150.69,49.58 D1.2 150.76,49.58 151.8,49.58 | 151.8,49.58 151.87,49.51 151.87,46.19 C4_USB.2 151.87,46.12 151.87,45.43 151.8,45.36 v151.59,45.36 | v151.59,42.94 151.8,42.94 151.87,43 C5_USB.2 | 151.8,49.58 151.8,50.62 153.87,52.7 156.16,52.7 R2-USB1.1 | 126.73,48.13 126.8,48.13 128.6,46.33 131.85,46.33 132.75,47.23 143.28,47.23 145.49,49.44 145.56,49.44 | 110.18,40.3 110.18,40.23 110.66,39.75 110.66,39.47 110.94,39.47 R1_PWRUSB.1 111.01,39.47 113.36,39.47 113.92,40.03 117.45,40.03 117.52,40.1 118.62,40.1 IC4.2 118.69,40.1 119.8,40.1 119.87,40.16 119.87,40.86 120.91,41.9 128.81,41.9 129.57,41.13 132.61,41.13 C1_BAT2.2 | 110.18,40.3 110.18,41.41 111.91,43.14 111.91,51.38 C2_BAT.2 111.91,51.52 111.91,52.42 111.98,52.49 112.46,52.49 112.74,52.77 114.32,52.77 114.32,52.78 116.28,52.78 116.28,52.77 124.72,52.77 125.14,53.18 126.8,53.18 127.7,54.08 128.81,54.08 C1_BAT.2 128.87,54.08 133.24,54.08 133.51,54.36 134.62,54.36 U4.1 134.69,54.36 135.66,54.36 135.66,53.67 U4.9 | 110.18,40.3 110.11,40.3 99.65,50.76 99.65,51.59 99.58,51.66 98.61,51.66 C10_SUPERCAP.1 98.54,51.66 v97.5,51.66 | J2.B12 164.47,51.31 163.5,51.31 163.43,51.24 163.43,51.11 163.5,51.04 164.47,51.04 J2.A1 164.54,51.04 165.09,51.04 165.09,50.34
  Top 0.15: 165.09,50.34 165.09,49.31 J2.MP3 | 168.9,50.34 168.97,50.28 168.97,49.31 J2.MP1 | 165.09,50.34 168.9,50.34 | U4.4 134.69,52.84 135.66,52.84 135.66,53.6 U4.9 | U4.9 135.73,53.39 136.63,53.39 U4.6 136.7,53.39 137.53,53.39 145.08,60.94 145.08,64.61 145.22,64.75 | 163.43,57.48 163.5,57.41 164.47,57.41 J2.B1 | 163.43,57.48 163.43,57.62 163.5,57.69 164.47,57.69 J2.A12 164.54,57.69 165.09,57.69 165.09,59.42 J2.MP4 165.09,59.49 165.09,60.45 165.16,60.52 168.9,60.52 J2.MP2 | 145.22,64.75 145.29,64.68 146.26,64.68 TP4.TP | 145.22,66.83 145.22,64.75 | 145.22,66.83 145.29,66.89 169.8,66.89 169.87,66.83 169.87,61.49 168.97,60.59 168.97,59.49 J2.MP2 | 168.9,50.34 168.9,58.24 168.97,58.31 168.97,59.42 J2.MP2
  Top 0.152: SENSOR2.5 152.99,9.6 152.99,9.41 152.84,9.25 152.24,9.25 152.09,9.41 152.09,9.62 SENSOR2.7 151.39,9.62 151.39,9.41 151.24,9.25 150.64,9.25 150.49,9.41 150.49,10.52 150.97,11 v150.97,11.7
  Bottom 0.15: v34.83,53.74 36.42,52.15 36.42,47.64 v36.15,47.37 | v9.28,49.44 11.29,51.45 11.29,52.49 v11.08,52.7 | v92.45,38.5 87.05,43.9 v87.05,44.6 87.12,44.6 90.37,47.85 93.69,47.85 v97.5,51.66 | v79.71,12.46 79.71,12.67 79.98,12.95 v79.98,19.32 79.92,19.32 76.59,22.64 v71.19,22.64 | v102.63,19.8 v104.43,19.8 | v82.34,12.19 82.96,12.19 83.03,12.12 83.24,12.12 84.14,11.22 84.14,11.01 84.48,10.66 84.76,10.66 85.11,11.01 85.11,11.84 84.48,12.46 v84.28,12.46 | v151.66,5.05 151.45,5.26 151.45,6.16 150.97,6.65 v150.97,11.7 151.03,11.7 151.24,11.91 151.31,11.91 156.92,17.52 156.92,19.88 157.13,20.08 157.13,37.33 151.59,42.87 v151.59,42.94 v151.59,45.36
  other vias: 73.8,3.4 17.1,42.6 89.3,52.7 90.1,62.3 78.4,33.5 74,26.6 161,54.9 120.7,50.8 115.3,51.8 79.9,35.9 39.8,28.2 16.7,39.7 82.4,10.9 94,14.6 154.5,47.4 150.2,38.2 155.4,49.5 96.6,50.1 28.8,93.1 56.4,36.6 32.6,62 99.9,3.9 47.6,56.8 19.9,49.2 2.8,67.4 56.3,106.1 41.5,37.2 82,16.6 89.2,16.2 89.1,20.1 89.6,13.1 89.2,36.9 42.2,56.1 20.7,66.2
  pour Top: 6.36,46.36 6.34,46.34 6.32,46.32 0.08,46.32 0.08,0.08 77.22,0.08 77.22,10.02 77.24,10.04 77.26,10.06 77.28,10.08 95.52,10.08 95.54,10.06 95.56,10.04 95.58,10.02 95.58,0.08 170.12,0.08 170.12,67.12 92.18,67.12 92.16,67.14 92.14,67.16 92.12,67.18 92.12,111.12 67.78,111.12 67.78,109.98 67.76,109.96 67.74,109.94 67.72,109.92 19.68,109.92 19.66,109.94 19.64,109.96 19.62,109.98 19.62,111.12 0.08,111.12 0.08,64.58 6.32,64.58 6.34,64.56 6.36,64.54 6.38,64.52 6.38,46.38
  pour Bottom: 6.36,46.36 6.34,46.34 6.32,46.32 0.08,46.32 0.08,0.08 77.22,0.08 77.22,10.02 77.24,10.04 77.26,10.06 77.28,10.08 95.52,10.08 95.54,10.06 95.56,10.04 95.58,10.02 95.58,0.08 170.12,0.08 170.12,67.12 92.18,67.12 92.16,67.14 92.14,67.16 92.12,67.18 92.12,111.12 67.78,111.12 67.78,109.98 67.76,109.96 67.74,109.94 67.72,109.92 19.68,109.92 19.66,109.94 19.64,109.96 19.62,109.98 19.62,111.12 0.08,111.12 0.08,64.58 6.32,64.58 6.34,64.56 6.36,64.54 6.38,64.52 6.38,46.38
GPIO8
  Top 0.15: R1.1 19.18,39.13 15.65,39.13 9.28,45.5 7.06,45.5 6.72,45.84 6.72,47.51 9.14,49.93 13.85,49.93 14.2,49.58 14.2,49.38 15.23,48.34 18.7,48.34 19.18,47.85 19.18,46.74 U2.10
I2C_PW  (via drill 0.3)
  Top 0.15: R2-PINH.2 157.06,5.12 155.95,5.12 155.88,5.19 154.01,5.19 R1-PINH.2 153.94,5.19 v152.84,5.19 152.84,4.64 152,3.81 150.9,3.81 C1.1 150.83,3.81 149.72,3.81 | v151.73,11.7 151.73,12.81 SENSOR2.2 | 149.72,3.81 149.58,3.95 147.99,3.95 C2.1 | v24.79,60.45 24.38,60.45 21.74,63.09 21.74,64.13 U2.17 | v99.86,7.06 99.51,6.72 99.51,4.46 99.34,4.46 99.34,3.35 99.51,3.35 99.86,3 99.86,0.35 99.93,0.28 146.26,0.28 149.72,3.74 149.72,3.81
  Top 0.152: v151.73,11.7 151.73,10.96 151.44,10.67 | 151.44,10.67 152.04,10.67 152.19,10.52 152.19,10.31 SENSOR2.6 | 151.44,10.67 151.29,10.52 151.29,10.31 SENSOR2.8
  Bottom 0.15: v151.73,11.7 151.24,11.22 151.24,6.79 v152.84,5.19 | v24.79,60.45 46.26,60.45 75.83,30.89 75.83,29.43 85.94,19.32 87.39,19.32 99.65,7.06 v99.86,7.06
INT_RTC  (via drill 0.3)
  Top 0.15: 94.73,60.11 94.04,60.11 R1-PINH1.1 | 94.73,60.11 94.8,60.18 94.8,62.12 91,65.93 87.19,65.93 87.12,65.86 87.12,62.26 87.05,62.19 87.05,61.15 87.19,61.01 87.19,60.25 86.84,59.9 86.63,59.9 86.56,59.83 | 86.56,59.83 86.56,58.72 U3.3 | v16.62,47.85 16.62,46.74 U2.8 | v42.03,59.28 42.52,58.79 49.72,58.79 50.97,60.04 86.28,60.04 86.49,59.83 86.56,59.83 | v110.52,9.42 110.73,9.21 110.73,3.74 109.69,2.7 108.72,2.7 TP15.TP | v109.69,41.34 109.48,41.34 99.93,50.9 99.93,55.33 95.15,60.11 94.73,60.11
  Bottom 0.15: v16.62,47.85 17.59,48.82 17.59,51.8 25.41,59.62 41.9,59.62 42.03,59.49 v42.03,59.28 | v110.52,9.42 110.52,19.32 110.66,19.46 110.66,40.37 v109.69,41.34
IO/BOOT  (via drill 0.3)
  Top 0.15: v19.25,107.41 20.01,107.41 R_BOOT.1 20.08,107.41 20.36,107.41 24.24,103.53 24.24,64.19 U2.15 | BOOT_BUTTON.4 22.3,109.21 v23.34,109.21 25.76,109.21 BOOT_BUTTON.3 | v27.15,107.34 27.21,107.41 27.98,107.41 C6.1
  Bottom 0.15: v19.25,107.41 21.47,109.62 22.92,109.62 | v23.34,109.21 22.92,109.62 | v27.15,107.34 24.86,109.62 22.92,109.62
IO/CHANGE  (via drill 0.3)
  Top 0.15: v45.98,107.27 45.98,107.48 45.84,107.61 45.15,107.61 C10.1 | v46.19,109.21 47.3,109.21 CHANGE_BUTTON.4 47.37,109.21 50.76,109.21 CHANGE_BUTTON.3 | v53.81,107.48 52.98,107.48 R_CHANGE.1 | v16.34,70.36 16.34,68.49 15.65,67.8 15.65,66.97 14.06,65.37 14.06,64.19 U2.23
  Bottom 0.15: v53.81,107.48 51.66,109.62 46.54,109.62 46.19,109.28 v46.19,109.21 45.98,109 v45.98,107.27 45.98,99.79 16.55,70.36 v16.34,70.36
MISO  (via drill 0.3)
  Top 0.15: TP6.TP 35.04,2.49 36.15,2.49 36.56,2.91 36.56,23.75 42.1,29.29 43.07,29.29 R8.1 43.14,29.29 v44.18,29.29 | D12.2 43,35.66 v43,36.49 v43,41.13 | v34.56,56.3 35.66,56.3 U1.2 | v23.34,56.37 23.34,55.88 22.99,55.54 16.48,55.54 9,63.02 v9,63.09 9,64.13 U2.27 | v3.88,93.76 4.99,93.76 J4.P7
  Bottom 0.15: v43,36.49 44.32,35.18 44.32,29.43 v44.18,29.29 | 31.82,59.04 31.79,59.07 25.69,59.07 23.34,56.72 v23.34,56.37 | 31.82,59.04 v34.56,56.3 | v3.88,93.76 0.28,90.16 0.28,71.81 v9,63.09 | v43,41.13 43.21,41.13 44.04,41.97 44.04,51.73 41.55,54.22 41.55,58.72 41.2,59.07 31.86,59.07 31.82,59.04
MOSI  (via drill 0.3)
  Top 0.15: v85.66,15.23 85.66,14.13 J1.14 | v47.09,29.29 45.98,29.29 R7.1 45.91,29.29 44.8,29.29 44.04,28.53 41.76,28.53 36.84,23.61 36.84,2.77 36.36,2.29 36.36,1.18 35.73,0.55 34.28,0.55 32.34,2.49 TP7.TP | v44.6,53.74 43.49,53.74 U1.5 43.42,53.74 v42.66,53.74 | v45.98,36.63 45.98,35.66 D11.2 | v15.37,47.85 15.37,46.74 U2.7 | v13.78,66.13 13.57,66.34 13.57,76.94 9.35,81.16 9.21,81.16 3.67,86.7 3.67,89.12 3.88,89.33 4.99,89.33 J4.P3
  Bottom 0.15: v85.66,15.23 85.66,17.66 74.72,28.6 47.78,28.6 v47.09,29.29 47.02,29.29 44.6,31.72 44.6,36.7 | 44.6,36.7 v44.6,53.74 | v45.98,36.63 45.91,36.7 44.6,36.7 | v15.37,47.85 16,47.85 16.48,48.34 16.69,48.34 17.31,48.96 17.31,51.94 18.39,53.01 | 18.39,53.01 25.28,59.9 42.03,59.9 42.66,59.28 42.66,56.66 42.76,56.66 42.76,55.55 42.66,55.55 v42.66,53.74 | v13.78,66.13 13.78,65.51 13.3,65.03 12.88,65.03 12.12,64.26 12.12,59.55 17.73,53.95 17.73,53.67 18.39,53.01
N$1
  Top 0.15: R2-USB1.2 156.23,54.02 162.39,54.02 163.29,53.12 164.47,53.12 J2.A5
N$3
  Top 0.15: R2-USB.1 146.39,50.07 148.47,50.07 149.58,51.18 151.94,51.18 155.33,54.57 155.33,54.71 155.4,54.78 156.92,54.78 157.34,54.36 158.31,54.36 159.97,56.02 163.29,56.02 163.36,56.09 164.47,56.09 J2.B5
N$5  (via drill 0.3)
  Top 0.15: C4.1 101.17,38.16 98.61,38.16 98.27,38.5 97.16,38.5 D3.2 97.09,38.5 v95.98,38.5 | v82.61,41.76 81.51,41.76 D4.1
  Bottom 0.15: v82.61,41.76 88.78,41.76 91.96,38.57 91.96,38.36 92.31,38.02 95.5,38.02 v95.98,38.5
N$6  (via drill 0.3)
  Top 0.15: v91,19.32 90.16,18.49 90.16,14.13 J1.5 | v87.39,39.82 87.19,39.61 86.98,39.61 86.63,39.27 79.71,39.27 73.41,32.96 v72.71,32.96 | v65.16,29.36 64.06,28.25 64.06,23.55 62.67,22.16 62.67,21.26 63.02,20.91 64.06,20.91 64.54,21.4 66.62,21.4 EPD_C2.2
  Bottom 0.15: v91,19.32 90.79,19.53 90.79,21.4 90.09,22.09 89.89,22.09 88.5,23.48 88.5,35.25 89.19,35.94 89.4,35.94 90.03,36.56 90.03,37.4 88.78,38.64 88.78,38.85 88.36,39.27 88.36,39.47 88.02,39.82 v87.39,39.82 | v72.71,32.96 71.33,31.58 71.33,30.33 70.98,29.98 68.07,29.98 67.66,30.4 66.83,30.4 66.55,30.12 66.34,30.12 66.06,29.85 65.65,29.85 v65.16,29.36
N$7  (via drill 0.3)
  Top 0.15: v90.72,16.62 90.72,14.13 J1.4 | v87.39,38.57 87.25,38.43 80.12,38.43 v73.27,31.58 | v66.62,29.36 66.27,29.02 66.27,28.81 64.33,26.87 64.33,21.61 64.26,21.54 63.57,21.54 EPD_C1.2
  Bottom 0.15: v90.72,16.62 90.51,16.62 87.39,19.74 v87.39,38.57 | v73.27,31.58 72.23,31.58 71.88,31.23 71.88,30.05 71.26,29.43 67.8,29.43 67.38,29.85 67.1,29.85 v66.62,29.36
N$8  (via drill 0.3)
  Top 0.15: v83.72,12.88 83.72,14.06 J1.18 | v85.39,10.66 85.66,10.39 96.47,10.39 97.16,9.7 98.54,9.7 v98.68,9.56 | v102.08,10.8 102.08,11.01 104.78,13.71 104.78,15.51 110.18,20.91 111.28,20.91 EPD_C6.2
  Bottom 0.15: v83.72,12.88 83.93,13.09 84.28,13.09 85.39,11.98 v85.39,10.66 | v98.68,9.56 100.83,9.56 v102.08,10.8
N$9
  Top 0.15: J1.20 82.68,14.06 82.68,12.46 83.17,11.98 84.48,11.98 84.55,11.91 91.06,11.91 92.45,13.3 93.56,13.3 94.6,14.34 95.01,14.34 100.27,19.6 100.27,21.05 100.34,21.12 101.45,21.12 EPD_C8.2
N$10  (via drill 0.3)
  Top 0.15: v83.17,12.6 83.17,14.06 J1.19 | v84.62,11.15 84.83,11.36 88.57,11.36 89.26,10.66 91.06,10.66 92.86,12.46 93.97,12.46 94.8,13.3 95.63,13.3 95.98,13.64 95.98,14.47 100.27,18.77 102.63,18.77 103.18,19.32 v104.08,19.32 | v105.19,20.91 106.3,20.91 EPD_C7.2
  Bottom 0.15: v83.17,12.6 v84.62,11.15 | v104.08,19.32 104.57,19.32 105.19,19.94 v105.19,20.91
N$11  (via drill 0.3)
  Top 0.15: v79.5,13.09 80.47,13.09 80.68,13.3 80.68,14.06 J1.24 | v79.15,19.46 79.15,21.26 79.22,21.33 80.33,21.33 EPD_C12.2
  Bottom 0.15: v79.5,13.09 79.71,13.3 79.71,18.91 v79.15,19.46
N$13  (via drill 0.3)
  Top 0.15: v80.81,12.81 81.44,12.81 81.72,13.09 81.72,14.06 J1.22 | v64.96,28.12 65.16,28.12 66,28.95 v66,29.36 | v73.27,32.2 73.47,32.2 79.98,38.71 86.91,38.71 87.25,39.06 87.53,39.06 v88.02,38.57 | v89.82,21.33 90.86,21.33 EPD_C10.2
  Bottom 0.15: v80.81,12.81 80.26,13.37 80.26,18.97 80.47,19.18 80.47,22.44 74.58,28.32 65.16,28.32 v64.96,28.12 | v66,29.36 66.48,29.85 66.69,29.85 66.97,30.12 67.52,30.12 67.93,29.71 71.12,29.71 71.61,30.19 71.61,31.37 72.09,31.86 72.92,31.86 v73.27,32.2 | v88.02,38.57 87.67,38.23 87.67,23.48 v89.82,21.33
N$14
  Top 0.15: D7.1 85.73,65.03 85.73,63.43 86.36,62.81 86.36,61.7 R_CAPACITOR.1
N$15  (via drill 0.3)
  Top 0.15: v117.72,35.94 117.72,34.83 C1_BAT1.1 | IC4.3 118.62,39.13 v117.72,39.13 117.52,39.13 117.45,39.06 114.47,39.06 D2.1 | v117.72,41.06 118.62,41.06 IC4.1 | v134.9,44.94 134.9,45.91 Q3.2
  Bottom 0.15: v117.72,35.94 v117.72,39.13 v117.72,41.06 131.02,41.06 v134.9,44.94
N$16
  Top 0.15: R1_BAT.2 115.51,49.93 115.58,50 116.96,50 117.31,49.65 123.82,49.65 124.72,48.75 125.76,48.75 U.1
N$17  (via drill 0.3)
  Top 0.15: v117.45,50.83 117.72,51.11 117.72,51.66 117.1,51.66 GHC_LED.C | v114.19,50.07 R1_BAT.1
  Bottom 0.15: v117.45,50.83 114.95,50.83 v114.19,50.07
N$18
  Top 0.15: IC1.5 50.9,101.8 52.08,101.8 52.98,100.9 52.98,100 53.05,99.93 54.15,99.93 C_DELAY.1
N$19
  Top 0.15: R2_BAT.2 121.12,45.91 122.09,45.91 122.16,45.98 122.16,48.68 122.23,48.75 123.13,48.75 U.5
PREVGH  (via drill 0.3)
  Top 0.15: v82.2,13.09 82.2,14.06 J1.21 | v89.4,11.15 89.61,11.36 91.34,11.36 92.73,12.74 93.83,12.74 94.87,13.78 v95.5,13.78 | v95.5,21.19 96.26,21.19 EPD_C9.2 | v95.43,33.31 94.32,33.31 D5.1
  Bottom 0.15: v82.2,13.09 82.48,13.37 84.42,13.37 85.66,12.12 88.43,12.12 v89.4,11.15 | v95.5,13.78 v95.5,21.19 95.43,21.19 v95.43,33.31
PREVGL  (via drill 0.3)
  Top 0.15: v81.16,13.3 81.16,14.06 J1.23 | v85.18,17.52 85.04,17.66 85.04,21.05 85.11,21.12 86.08,21.12 EPD_C11.2 86.15,21.12 87.25,21.12 88.99,22.85 v88.99,23.61 | v87.95,40.3 86.49,41.76 84.97,41.76 D4.2
  Bottom 0.15: v81.16,13.3 81.37,13.3 83.58,15.51 83.58,16.34 84.76,17.52 v85.18,17.52 | v87.95,40.3 88.64,39.61 88.64,39.4 89.06,38.99 89.06,38.78 90.3,37.53 90.3,36.42 89.54,35.66 89.33,35.66 88.78,35.11 88.78,23.82 v88.99,23.61
RESE
  Top 0.15: J1.3 91.2,14.13 91.2,15.1 91.27,15.17 95.43,15.17 100,19.74 100,21.19 100.62,21.81 102.28,21.81 103.11,20.98 103.11,19.67 102.49,19.04 100.14,19.04 95.15,14.06 94.73,14.06 93.69,13.02 92.59,13.02 91.2,11.63 84.42,11.63 84.35,11.7 81.09,11.7 79.78,10.39 76.59,10.39 68.77,2.56 68.77,1.52 68.7,1.45 66.06,1.45 64.4,3.12 64.4,11.43 64.33,11.49 63.23,11.49 R3.2 63.16,11.49 62.05,11.49 61.98,11.56 61.98,12.6 59.83,14.75 59.83,18 Q1.2
RESE'
  Top 0.15: R3.1 63.16,10.18 58.66,10.18 58.66,10.04 SJ1.2 58.66,10.25 58.66,11.15 59.69,12.19 59.69,13.37 R2.2
RESET  (via drill 0.3)
  Top 0.15: RESET_BUTTON.4 62.26,109.21 65.65,109.21 RESET_BUTTON.3 65.72,109.21 66.69,109.21 v66.83,109.35 | v48.89,102.21 48.89,102 48.68,101.8 48.06,101.8 IC1.1 | v55.26,101.73 55.47,101.73 60.73,106.99 60.73,107.55 60.18,107.55 R_RESET.1 | v66.76,107.2 66.76,107.34 67.03,107.61 67.8,107.61 C5.1 | v10.25,47.85 10.25,46.74 U2.3
  Bottom 0.15: 49.55,101.56 49.58,101.52 55.05,101.52 | 49.55,101.56 v48.89,102.21 | v55.26,101.73 55.05,101.52 | 55.05,101.52 61.08,101.52 v66.76,107.2 66.83,107.2 v66.83,109.35 | v10.25,47.85 6.72,51.38 6.72,60.11 48.13,101.52 49.51,101.52 49.55,101.56
RTC_RST  (via drill 0.3)
  Top 0.15: v22.99,66.06 U2.16 | v84.62,57.48 85.25,57.48 85.32,57.55 85.32,58.66 U3.4
  Bottom 0.15: v22.99,66.06 23.27,66.34 72.09,66.34 80.95,57.48 v84.62,57.48
RX  (via drill 0.3)
  Top 0.15: v12.81,63.09 12.81,64.13 U2.24 | v71.74,101.24 71.95,101.24 72.02,101.17 73.13,101.17 TP2.TP
  Bottom 0.15: v12.81,63.09 13.02,63.09 13.5,63.57 13.5,64.82 14.06,65.37 14.06,65.79 14.27,66 14.27,66.83 15.58,68.14 16,68.14 16.34,68.49 16.34,69.32 48.27,101.24 v71.74,101.24
SCK  (via drill 0.3)
  Top 0.15: 38.3,29.36 38.16,29.36 38.09,29.29 38.09,25.69 36.29,23.89 36.29,12.74 26.11,2.56 25,2.56 TP8.TP | 38.3,29.36 39.13,29.36 R6.1 | v86.22,18.84 86.22,14.13 J1.13 | v44.6,55.05 43.49,55.05 U1.6 | v39.33,36.84 39.33,35.73 D10.2 | v14.68,45.57 14.2,45.57 14.06,45.7 14.06,46.67 U2.6 | v13.3,65.65 13.3,76.8 9.28,80.81 9.14,80.81 3.39,86.56 3.39,89.26 3.67,89.54 3.67,91.2 4.02,91.55 4.99,91.55 J4.P5 | 38.3,29.36 38.3,33.31 35.8,35.8 v35.59,35.8
  Bottom 0.15: v86.22,18.84 86.01,18.84 75.55,29.29 75.55,30.75 51.24,55.05 v44.6,55.05 44.6,54.98 44.11,54.5 44.11,53.6 44.32,53.39 44.32,41.83 v39.33,36.84 39.27,36.84 38.02,35.59 35.59,35.59 | 35.59,35.59 31.92,35.59 22.99,44.53 22.99,44.94 22.64,45.29 22.37,45.29 22.16,45.08 14.96,45.08 14.68,45.36 v14.68,45.57 14.61,45.43 11.84,48.2 11.84,64.4 13.09,65.65 v13.3,65.65 | 35.59,35.59 v35.59,35.8
SCL  (via drill 0.3)
  Top 0.15: v155.95,3.81 157.06,3.81 R2-PINH.1 | v153.32,11.7 153.32,12.81 SENSOR2.4 153.32,12.95 153.32,13.99 153.39,14.06 163.29,14.06 166.41,17.17 166.41,20.71 166.34,20.77 165.37,20.77 J3.4 165.3,20.77 v156.37,20.77 | v137.39,53.88 136.7,53.88 U4.7 | v89.4,47.92 89.12,48.2 89.12,49.31 U3.16 | v17.87,65.3 17.87,64.19 U2.20
  Bottom 0.15: v155.95,3.81 155.95,9.07 v153.32,11.7 | 89.61,48.13 93.56,48.13 97.02,51.59 97.02,51.8 99.31,54.08 137.18,54.08 v137.39,53.88 137.95,53.88 138.15,54.08 139.4,54.08 151.31,42.17 151.45,42.17 156.57,37.05 156.57,20.98 v156.37,20.77 | 89.61,48.13 v89.4,47.92 | v17.87,65.3 41.83,65.3 59,48.13 89.61,48.13
SDA  (via drill 0.3)
  Top 0.15: v137.81,54.36 136.7,54.36 U4.8 | v156.64,20.22 156.92,20.5 163.5,20.5 164.19,19.8 165.3,19.8 J3.3 | v152.84,3.95 153.94,3.95 R1-PINH.1 | v152.56,13.78 152.56,12.88 SENSOR2.3 | v19.18,65.79 19.18,64.19 U2.19 | v87.74,50.76 87.74,50.55 87.81,50.48 87.81,49.38 U3.15
  Bottom 0.15: v152.84,3.95 152.21,4.57 151.52,4.57 151.17,4.92 151.17,6.03 150.69,6.51 150.69,11.36 150.48,11.56 150.48,11.84 150.83,12.19 151.17,12.19 152.66,13.68 | 152.66,13.68 156.64,17.66 v156.64,20.22 156.85,20.43 156.85,37.19 151.59,42.45 151.45,42.45 139.54,54.36 v137.81,54.36 99.17,54.36 96.74,51.94 96.74,51.73 93.42,48.41 85.39,48.41 | 152.66,13.68 v152.56,13.78 | v19.18,65.79 19.39,65.58 41.97,65.58 59.14,48.41 85.39,48.41 | v87.74,50.76 85.39,48.41
SRC  (via drill 0.3)
  Top 0.15: 91.96,38.64 92.8,39.47 101.17,39.47 C4.2 | 91.96,38.64 91.96,37.95 96.6,33.31 97.71,33.31 D5.2 | v64.26,29.09 64.26,28.88 63.78,28.39 63.78,27.56 61.56,25.35 61.35,25.35 59.14,23.13 59.14,20.15 Q1.3 | v73.89,31.58 73.89,31.79 74.79,32.69 v75,32.69 | v76.11,33.1 76.11,33.31 77.91,35.11 79.84,35.11 79.92,35.04 81.02,35.04 L1.1 | 91.96,38.64 90.23,38.64 89.19,37.6 86.49,37.6 v86.36,37.46
  Bottom 0.15: v64.26,29.09 64.47,28.88 71.53,28.88 72.44,29.78 72.44,30.12 v73.89,31.58 | v75,32.69 75.69,32.69 v76.11,33.1 76.17,33.1 80.54,37.46 v86.36,37.46
SS_SD  (via drill 0.3)
  Top 0.15: v11.56,47.85 11.56,46.74 U2.4 | v15.86,68.63 15.65,68.83 15.65,83.45 16.34,84.14 16.34,92.31 16.62,92.59 16.62,98.06 15.17,99.51 15.17,99.72 15.1,99.79 13.5,99.79 13.43,99.72 13.43,99.03 13.37,98.96 12.88,98.96 D8.2 12.74,98.96 11.63,98.96 11.49,99.1 9.07,99.1 R10.1 9,99.1 8.31,99.1 6.72,97.5 6.72,91.2 6.44,90.92 6.44,88.29 6.37,88.22 5.4,88.22 J4.P2
  Bottom 0.15: v11.56,47.85 11.56,64.54 15.65,68.63 v15.86,68.63
TX  (via drill 0.3)
  Top 0.15: v13.16,62.6 12.12,62.6 11.56,63.16 11.56,64.13 U2.25 | v79.29,100.76 79.64,101.11 80.75,101.11 TP1.TP
  Bottom 0.15: v13.16,62.6 13.16,62.81 13.78,63.43 13.78,64.68 14.34,65.23 14.34,65.65 14.54,65.86 14.54,66.69 15.72,67.86 16.14,67.86 16.62,68.35 16.62,69.18 48.41,100.97 71.4,100.97 71.61,100.76 v79.29,100.76
USB_D+  (via drill 0.3)
  Top 0.15: v149.58,50.55 150.69,50.55 D1.1 | v18.21,53.88 24.24,47.85 24.24,46.74 U2.14
  Bottom 0.15: v149.58,50.55 133.24,66.89 21.53,66.89 21.53,67.03 19.87,67.03 19.87,66.89 18.42,66.89 17.31,65.79 16.48,65.79 16.14,65.44 16.14,55.95 v18.21,53.88
USB_D-  (via drill 0.3)
  Top 0.15: v149.58,48.61 150.69,48.61 D1.3 | v17.94,54.78 17.94,54.22 17.73,54.02 17.73,53.74 18.07,53.39 18.28,53.39 23.06,48.61 23.06,47.92 22.99,47.85 22.99,46.74 U2.13
  Bottom 0.15: v149.58,48.61 149.58,49.93 149.09,50.41 149.09,50.62 133.1,66.62 21.25,66.62 21.25,66.75 20.14,66.75 20.14,66.62 18.56,66.62 17.45,65.51 16.62,65.51 16.41,65.3 16.41,56.09 17.73,54.78 v17.94,54.78
VBAT
  Top 0.3: U4.2 134.69,53.81 134.69,53.39 U4.3 134.55,53.32 134.21,53.32 134,53.12 134,52.42 | 134,52.42 134,50.62 | 134,50.62 134,48.13 Q3.3 | 134,52.42 137.12,52.42 145.22,60.52 146.39,60.52 TP3.TP | 134,50.62 125.9,50.62 U.3 125.76,50.62 125.41,50.62 124.86,50.07 117.45,50.07 116.13,51.38 115.93,51.38 115.93,51.17 114.67,51.17 114.67,51.38 113.27,51.38 C2_BAT.1
VBUS  (via drill 0.3)
  Top 0.3: D1.5 153.18,49.51 152.77,49.51 152.35,49.1 152.35,48.2 153.11,47.44 153.11,46.19 C4_USB.1 153.04,46.05 151.52,44.53 150.97,44.53 147.02,40.58 | C5_USB.1 153.11,43.77 153.11,39.2 152.63,38.71 PFMF.050.1.2 152.49,38.64 150.41,36.56 147.23,36.56 147.02,36.77 147.02,40.58 | C1_BAT.1 128.81,52.77 125.27,52.77 123.27,50.76 U.4 123.13,50.69 122.23,51.59 118.62,51.59 GHC_LED.A 118.49,51.73 118.21,51.73 117.59,52.35 115.93,52.35 115.93,52.43 114.67,52.43 114.67,52.35 112.88,52.35 112.53,52.01 112.53,40.86 | 112.53,40.86 114.19,40.86 114.4,41.06 D2.2 114.61,41.13 115.09,41.62 119.32,41.62 123.61,45.91 133.03,45.91 Q3.1 133.17,45.84 138.36,40.65 146.88,40.65 147.02,40.58 | 112.53,40.86 111.01,40.86 R1_PWRUSB.2 110.87,40.79 110.59,40.79 110.59,41.27 110.87,41.55 v110.94,41.55 | v116.48,2.7 118.9,2.7 TP14.TP
  Bottom 0.3: v116.48,2.7 109.97,9.21 109.97,19.32 110.25,19.6 110.25,40.23 109.69,40.79 109.48,40.79 109.14,41.13 109.14,41.55 109.48,41.9 110.59,41.9 v110.94,41.55
VRTC
  Top 0.3: R_CAPACITOR.2 87.6,61.63 87.6,60.11 87.19,59.69 87.19,50 86.56,49.38 U3.14 86.63,49.24 86.63,48.82 88.29,47.16 | 88.29,47.16 88.29,45.77 C8.1 | C10_SUPERCAP.2 98.54,49.38 94.46,49.38 92.31,47.23 88.43,47.23 88.29,47.16
VUSB
  Top 0.3: J2.A9 164.54,56.85 164.54,56.65 J2.B4 164.68,56.58 165.16,56.58 165.37,56.37 165.37,52.35 165.16,52.15 164.68,52.15 J2.B9 164.54,52.08 164.54,51.87 J2.A4 164.4,51.8 160.04,51.8 152.77,44.53 152.7,44.53 152.49,44.32 152.49,43.07 148.13,38.71 PFMF.050.1.1
(copper drawn outside any net)
  shapes: Top area x12